# Altium schematic sheet RADC-ModuleConnect-S06-V00.SchDoc
size A3; SheetNumber: 7; SheetTotal: 7
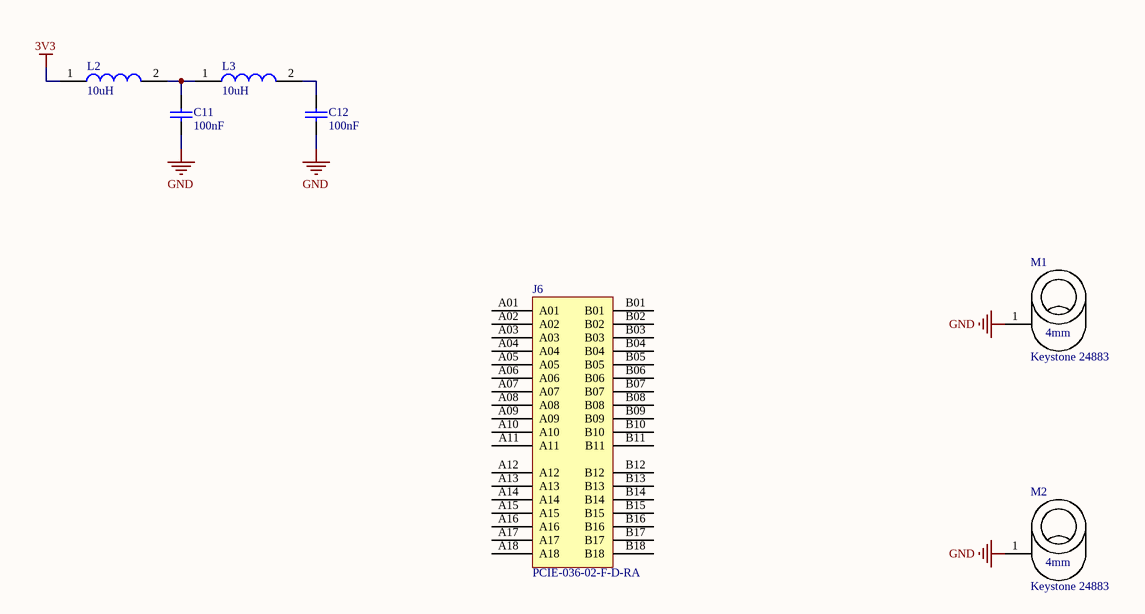
[diagram p0: RADC-ModuleConnect-S06-V00.SchDoc]

## Parts
C11  100nF  [Cap_Ceramic_0603]
C12  100nF  [Cap_Ceramic_0603]
J6  PCIE-036-02-F-D-RA  [PCIE-036-02-F-D-RA]
L2  10uH  [Inductor_0603]
L3  10uH  [Inductor_0603]
M1  Keystone 24883  [Keystone 24883]
M2  Keystone 24883  [Keystone 24883]

## Nets
3V3: L2.1
GND: C11.1 C12.1 M1.1 M2.1
NetC11_2: C11.2 L2.2 L3.1
NetC12_2: C12.2 L3.2

Not connected (* = marked no-connect by the designer): J6 A01 A02 A03 A04 A05 A06 A07 A08 A09 A10 A11 A12 A13 A14 A15 A16 A17 A18 B01 B02 B03 B04 B05 B06 B07 B08 B09 B10 B11 B12 B13 B14 B15 B16 B17 B18

## Notes on the sheet
- Revision History:
- Sheet Title:
- Rev
- Date
- Description
- Project:
- Size:
- Drawn By:
- A3
- Number:
- Revision:
- Sheet
- Version:
- of
- QUT Motorsport
- O-120, Gardens Point
- 2 George Street
- Brisbane, QLD 4000
- Australia
- Print Date:
- Print Time:
- File Name:
- (in symbol Keystone 24883) 4mm

## Library data of the parts
C11 C12 = 100nF 50V 5% X7R 0603: Capacitor, Ceramic, SMD, 100nF, 50V, 5%, X7R, 0603
J6 = PCIE-036-02-F-D-RA: 36 Position Female Connector PCI Express™ Gold 0.039" (1.00mm) Black
L2 L3 = 10uH, 10%, 0603: ComponentLink1Description: Digikey; ComponentLink1URL: https://www.digikey.com.au/product-detail/en/w%C3%BCrth-elektronik/74404064221/732-7261-1-ND/5353241; ComponentLink2Description: LCSC A; ComponentLink2URL: https://lcsc.com/product-detail/Power-Inductors_Sunlord-SWPA6045S221MT_C91047.html; ComponentLink3Description: LCSC B; ComponentLink3URL: https://lcsc.com/product-detail/Power-Inductors_SXN-Shun-Xiang-Nuo-Elec-SMNR6045-221MT_C467145.html
M1 M2 = Keystone 24883: Round Standoff Threaded M3x0.5 Steel 0.160" (4.06mm)